# Altium schematic sheet Control.SchDoc
size A4
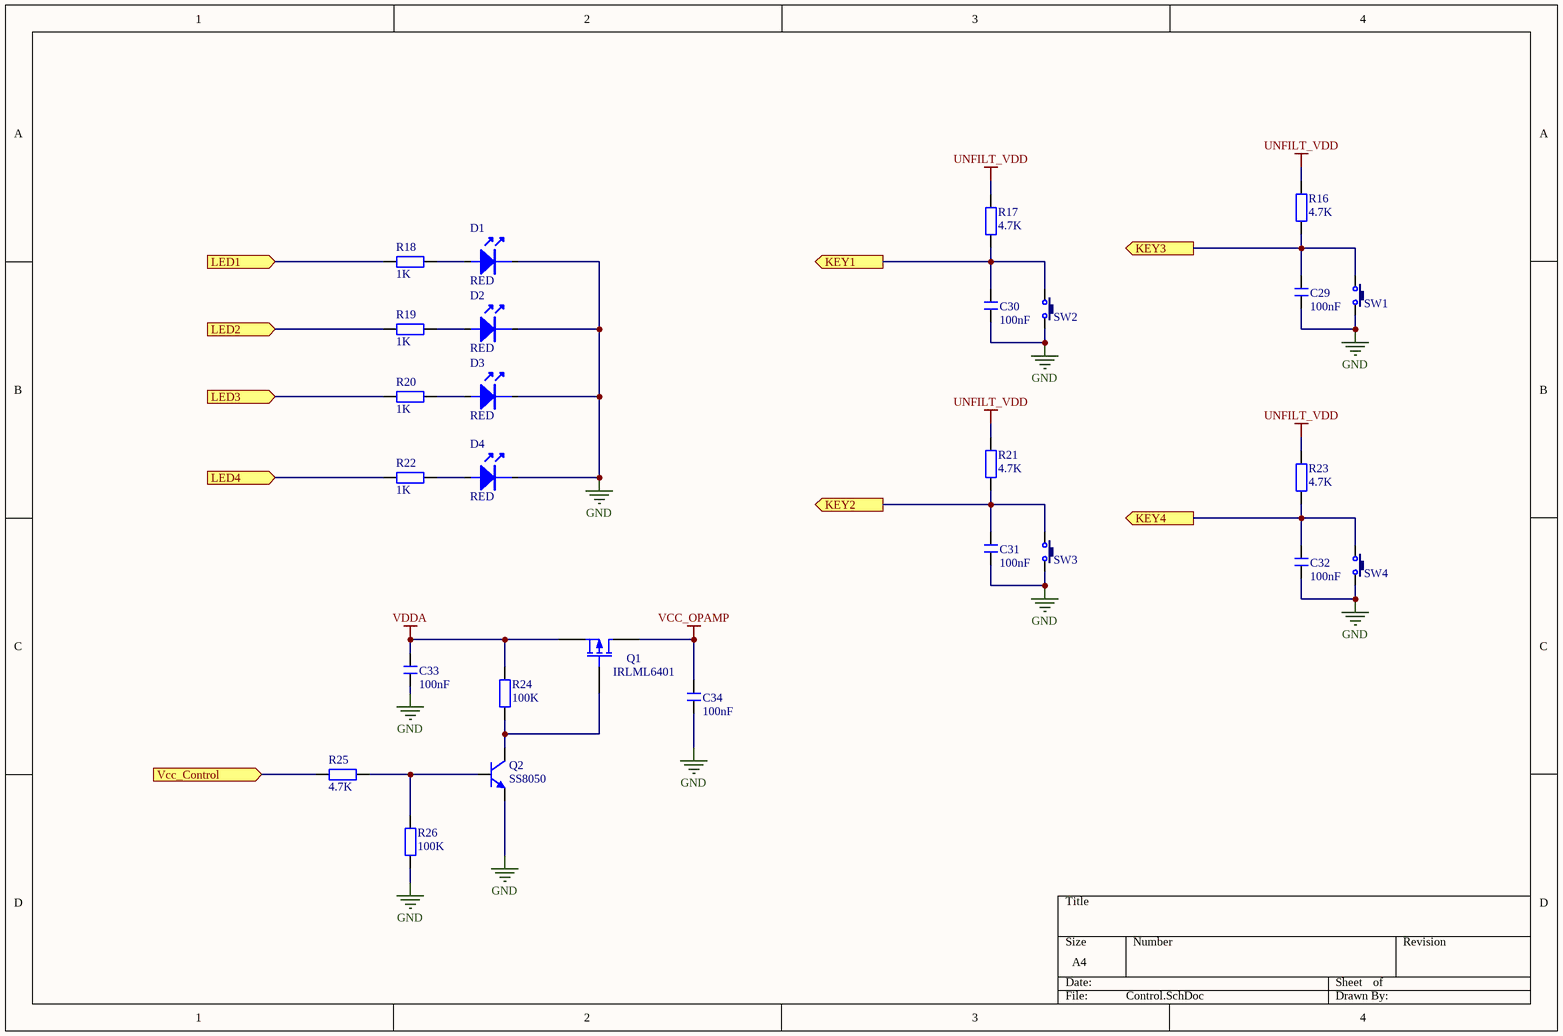
[diagram p0: Control.SchDoc]

## Parts
C29  100nF  [C 0603_L]
C30  100nF  [C 0603_L]
C31  100nF  [C 0603_L]
C32  100nF  [C 0603_L]
C33  100nF  [C 0603_L]
C34  100nF  [C 0603_L]
D1  RED  [0603D]
D2  RED  [0603D]
D3  RED  [0603D]
D4  RED  [0603D]
Q1  IRLML6401  [SOT-23_N]
Q2  SS8050  [SOT23-3N]
R16  4.7K  [R 0603_L]
R17  4.7K  [R 0603_L]
R18  1K  [R 0603_L]
R19  1K  [R 0603_L]
R20  1K  [R 0603_L]
R21  4.7K  [R 0603_L]
R22  1K  [R 0603_L]
R23  4.7K  [R 0603_L]
R24  100K  [R 0603_L]
R25  4.7K  [R 0603_L]
R26  100K  [R 0603_L]
SW1  3x6x5  [TSW SMD-3*6*2.5]  (value not drawn)
SW2  3x6x5  [TSW SMD-3*6*2.5]  (value not drawn)
SW3  3x6x5  [TSW SMD-3*6*2.5]  (value not drawn)
SW4  3x6x5  [TSW SMD-3*6*2.5]  (value not drawn)

## Ports
KEY1 (out), KEY2 (out), KEY3 (out), KEY4 (out), LED1 (in), LED2 (in), LED3 (in), LED4 (in), Vcc_Control (in)

## Nets
GND: C29.2 C30.2 C31.2 C32.2 C33.1 C34.1 D1.2 D2.2 D3.2 D4.2 Q2.2(E) R26.2 SW1.2 SW2.2 SW3.2 SW4.2
UNFILT_VDD: R16.2 R17.2 R21.2 R23.2
VCC_OPAMP: C34.2 Q1.3(D)
VDDA: C33.2 Q1.2(S) R24.1
KEY1: C30.1 R17.1 SW2.1 ; port KEY1
KEY2: C31.1 R21.1 SW3.1 ; port KEY2
KEY3: C29.1 R16.1 SW1.1 ; port KEY3
KEY4: C32.1 R23.1 SW4.1 ; port KEY4
LED1: R18.1 ; port LED1
LED2: R19.1 ; port LED2
LED3: R20.1 ; port LED3
LED4: R22.1 ; port LED4
Vcc_Control: R25.2 ; port Vcc_Control
NetD1_1: D1.1 R18.2
NetD2_1: D2.1 R19.2
NetD3_1: D3.1 R20.2
NetD4_1: D4.1 R22.2
NetQ1_1: Q1.1(G) Q2.3(C) R24.2
NetQ2_1: Q2.1(B) R25.1 R26.1

## Library data of the parts
C29-C34 = C: 贴片电容; BOM名称: 无极性贴片电容; 淘宝ID: 封装库来自淘宝 ID：黄晶宝石; 联系售后，技术支持: https://shop463601444.taobao.com; 唯一出售店铺网址: https://shop463601444.taobao.com
D1-D4 = LED
Q1 = MOSFET-P: P-Channel MOSFET; Published: 8-Jun-2000; LatestRevisionDate: 17-Jul-2002; LatestRevisionNote: Re-released for DXP Platform.; PackageVersion: 1995/1996; PackageReference: E3; Publisher: Altium Limited; PackageDescription: TO, Flat Index; 3 In-Line, Axial Leads; Body Dia. 4.6mm; Lead Dia. 0.5 mm (max)
Q2 = 8050-SMD: 高频放大-NPN型; 版权归属: 封装库来自淘宝 ID：黄晶宝石; 属性: 40V 1.5A 1W 100MHZ; BOM名称: 高频放大-NPN型; 联系售后: https://shop463601444.taobao.com
R16-R26 = R: 贴片电阻; 版权归属: 来自淘宝 ID：黄晶宝石; 封装库来自淘宝卖家 ID：黄晶宝石: 其他店铺购入均为盗版，不享受售后技术支持服务，请立即申请退款; BOM名称: 贴片电阻; 联系售后: https://shop463601444.taobao.com
SW1-SW4 = TSW 3x6: 3x6轻触开关; 版权归属: 封装库来自淘宝 ID：黄晶宝石; BOM名称: 3x6轻触开关; 学习资源: https://shop463601444.taobao.com